# EAGLE design BigTime45 (EAGLE 7.6.0)
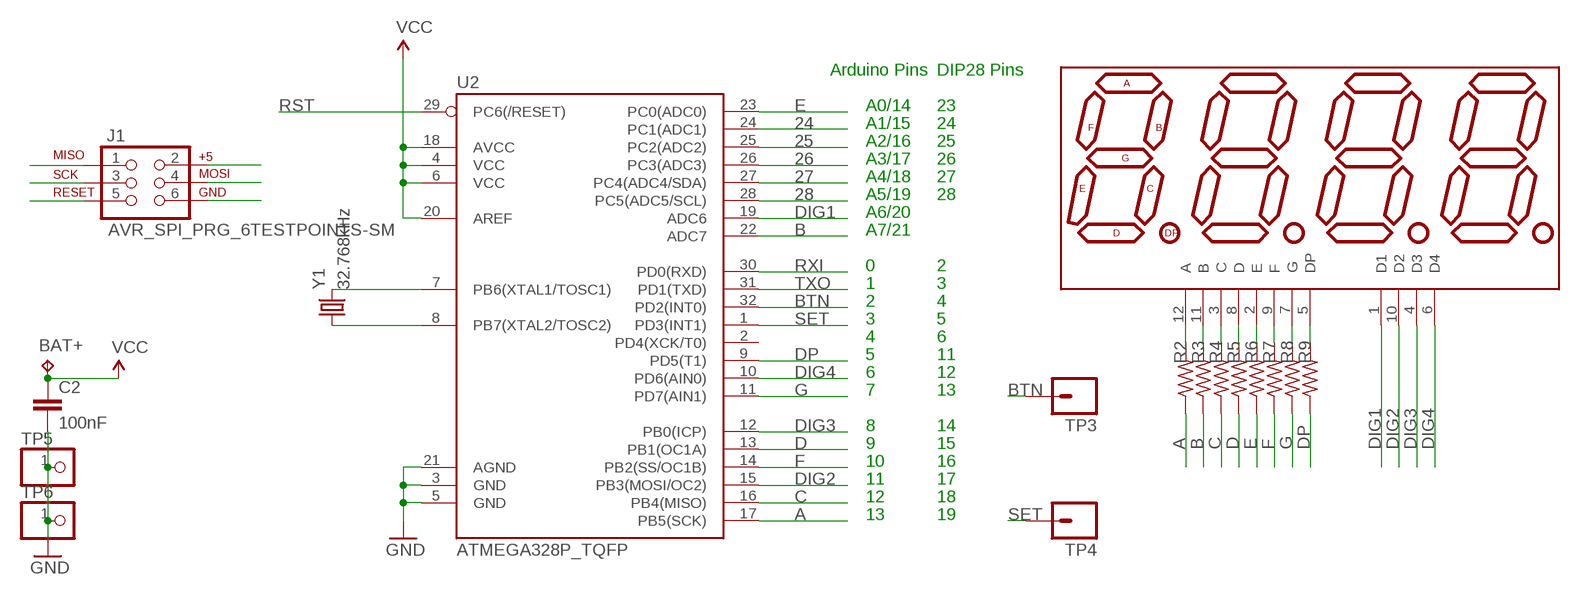
[diagram p0: schematic, sheet 1]

## Parts
BAT+  TPTP20R  [TP20R]
C2  100nF  C-EUC0805  [C0805]
DISP1  7-SEGMENT-4DIGIT-COUNTER-HP-BUBBLE-SM  [DIL12_SM]
J1  AVR_SPI_PRG_6TESTPOINTS-SM  [2X3_TEST_POINTS_SM]
R2  330  R-US_R0805  [R0805]
R3  330  R-US_R0805  [R0805]
R4  330  R-US_R0805  [R0805]
R5  330  R-US_R0805  [R0805]
R6  330  R-US_R0805  [R0805]
R7  330  R-US_R0805  [R0805]
R8  330  R-US_R0805  [R0805]
R9  330  R-US_R0805  [R0805]
TP3  M01EDGE_CONTACT  [WATCHBTN]
TP4  M01EDGE_CONTACT  [WATCHBTN]
TP5  PINHD-1X1CB  [1X01-CLEANBIG]
TP6  PINHD-1X1CB  [1X01-CLEANBIG]
U2  ATMEGA328P_TQFP  [TQFP32-08]
Y1  32.768kHz  CRYSTALTC26H  [TC26H]

## Nets
24: U2.24(PC1(ADC1))
25: U2.25(PC2(ADC2))
26: U2.26(PC3(ADC3))
27: U2.27(PC4(ADC4/SDA))
28: U2.28(PC5(ADC5/SCL))
A: J1.3 R2.1 U2.17(PB5(SCK))
B: R3.1 U2.22(ADC7)
BTN: TP3.1 U2.32(PD2(INT0))
C: J1.1 R4.1 U2.16(PB4(MISO))
D: R5.1 U2.13(PB1(OC1A))
DIG1: DISP1.1(D1) U2.19(ADC6)
DIG2: DISP1.10(D2) J1.4 U2.15(PB3(MOSI/OC2))
DIG3: DISP1.4(D3) U2.12(PB0(ICP))
DIG4: DISP1.6(D4) U2.10(PD6(AIN0))
DP: R9.1 U2.9(PD5(T1))
E: R6.1 U2.23(PC0(ADC0))
F: R7.1 U2.14(PB2(SS/OC1B))
G: R8.1 U2.11(PD7(AIN1))
GND: C2.2 J1.6 TP5.1 TP6.1 U2.3(GND) U2.5(GND) U2.21(AGND)
N$1: U2.8(PB7(XTAL2/TOSC2)) Y1.1
N$2: U2.7(PB6(XTAL1/TOSC1)) Y1.2
N$4: DISP1.12(A) R2.2
N$5: DISP1.11(B) R3.2
N$6: DISP1.3(C) R4.2
N$7: DISP1.8(D) R5.2
N$8: DISP1.2(E) R6.2
N$9: DISP1.9(F) R7.2
N$10: DISP1.7(G) R8.2
N$11: DISP1.5(DP) R9.2
RST: J1.5 U2.29(PC6(/RESET))
RXI: U2.30(PD0(RXD))
SET: TP4.1 U2.1(PD3(INT1))
TXO: U2.31(PD1(TXD))
VCC: BAT+.TP C2.1 J1.2 U2.4(VCC) U2.6(VCC) U2.18(AVCC) U2.20(AREF)
Unconnected: U2.2(PD4(XCK/T0))

## Notes on the sheet
- Arduino Pins | DIP28 Pins
- A0/14 | 23
- A1/15 | 24
- A2/16 | 25
- A3/17 | 26
- A4/18 | 27
- A5/19 | 28
- A6/20
- A7/21
- 0 | 2
- 1 | 3
- 2 | 4
- 3 | 5
- 4 | 6
- 5 | 11
- 6 | 12
- 7 | 13
- 8 | 14
- 9 | 15
- 10 | 16
- 11 | 17
- 12 | 18
- 13 | 19

## Library data of the parts
BAT+ = testpad:TP: Test pad
C2 = resistor:C-EU: CAPACITOR, European symbol
DISP1 = BigTime:7-SEGMENT-4DIGIT-COUNTER: HP Bubble display, with pins bent under and clipped, for surface-mounting.
J1 = Connectors:AVR_SPI_PRG_6: AVR ISP 6 Pin This is the reduced ISP connector for AVR programming. Common on Arduino. This footprint will take up less PCB space and can be used with a 10-pin to 6-pin adapter such as SKU: BOB-08508 **Special note about "TEST_POINT" package. The stop mask is on the top side, so if you want your programming test points to be on the bottom of your board, make sure to place this package on the bottom side of the board. This also ensure that the orientation to program from the bottom side will be correct.
R2-R9 = resistor:R-US_: RESISTOR, American symbol
TP3 TP4 = Connectors:M01: Header 1 Standard 1-pin 0.1" header. Use with straight break away headers (SKU : PRT-00116), right angle break away headers (PRT-00553), swiss pins (PRT-00743), machine pins (PRT-00117), and female headers (PRT-00115). SMTSO-256-ET is a "flush mount" nut for a 4-40 screw. The older package used to be too tight, and did not allow it to sit properly thru the drill hit. The latest (0.165DIA) fits nice and snug.
TP5 TP6 = adafruit:PINHD-1X1: Pin header 1x1 for 0.1" spacing With round pins
U2 = SparkFun-DigitalIC:ATMEGA328P_TQFP; PROD_ID: IC-09069
Y1 = BigTime:CRYSTAL: CRYSTAL; OC_FARNELL: unknown; OC_NEWARK: unknown

## Board
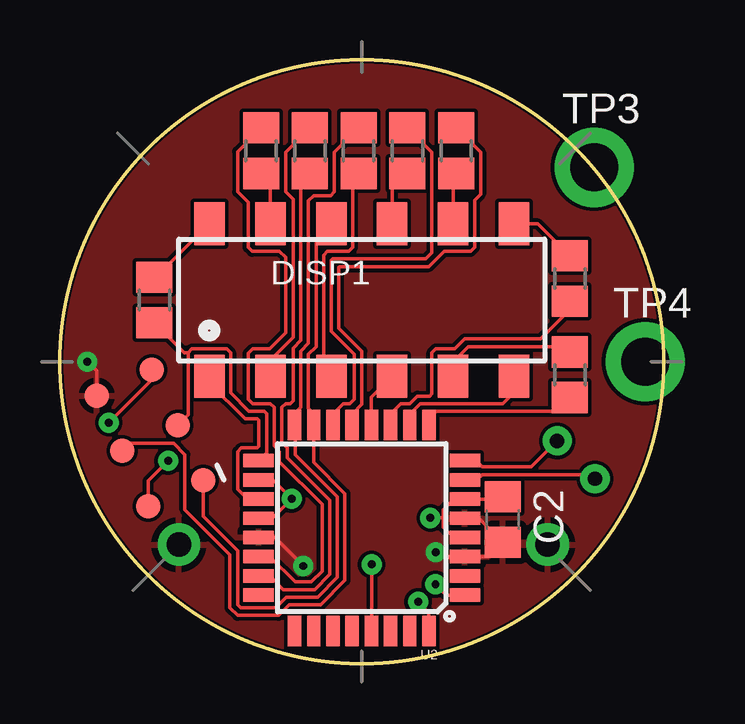
[diagram p1: board, top side]
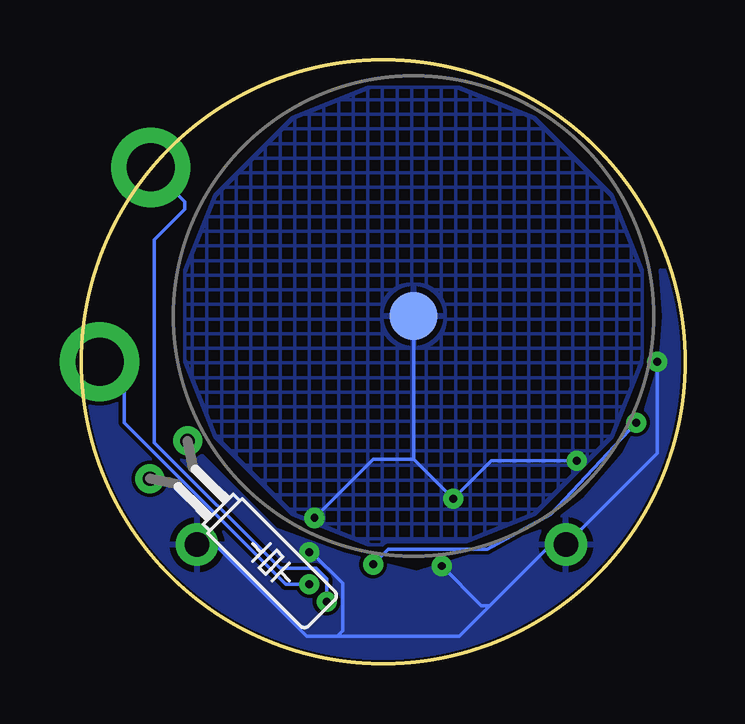
[diagram p2: board, bottom side, seen from below]

Size 25.15 x 25.15 mm. Coordinates in mm from the lower left corner, seen from the top.
Outline: circle at 12.57,12.57 radius 12.57
Copper layers (1*16): Top 0.0028mm / dielectric 30mil / Bottom 0.0028mm
Design rules "oshpark *": minimum track width 6mil, minimum drill 13mil, track to track 6mil, track to pad 6mil, pad to pad 6mil, via to via 6mil, smd to smd 6mil, copper to edge 3mil, drill to drill 6mil, minimum pad ring 12mil, minimum via ring 10mil, stop-mask expansion 4mil, vias tented up to drill 20mil, thermal gap 10mil

### Footprints (pad centres in the part's own frame; a part is rotated, then mirrored left to right if it is on the bottom)
TP20R = smd 2 x 2: TP 0,0
C0805 = smd 1.3 x 1.5: 1 -0.95,0; 2 0.95,0
DIL12_SM = smd 1.27 x 1.778: 1 -6.35,-3.175; 2 -3.81,-3.175; 3 -1.27,-3.175; 4 1.27,-3.175; 5 3.81,-3.175; 6 6.35,-3.175; 7 6.35,3.175; 8 3.81,3.175; 9 1.27,3.175; 10 -1.27,3.175; 11 -3.81,3.175; 12 -6.35,3.175
2X3_TEST_POINTS_SM = smd 1.016 x 1.016: 1 -2.54,-1.27; 2 -2.54,1.27; 3 0,-1.27; 4 0,1.27; 5 2.54,-1.27; 6 2.54,1.27
R0805 = smd 1.3 x 1.5: 1 -0.95,0; 2 0.95,0
1X01_2MM = drill 2 pad 3.302: 1 0,0
1X01-CLEANBIG = drill 1.016 pad 1.778: 1 0,0
TQFP32-08 = smd 1.27 x 0.559: 1 -4.293,2.8; 2 -4.293,2; 3 -4.293,1.2; 4 -4.293,0.4; 5 -4.293,-0.4; 6 -4.293,-1.2; 7 -4.293,-2; 8 -4.293,-2.8; 17 4.293,-2.8; 18 4.293,-2; 19 4.293,-1.2; 20 4.293,-0.4; 21 4.293,0.4; 22 4.293,1.2; 23 4.293,2; 24 4.293,2.8 | smd 0.559 x 1.27: 9 -2.8,-4.293; 10 -2,-4.293; 11 -1.2,-4.293; 12 -0.4,-4.293; 13 0.4,-4.293; 14 1.2,-4.293; 15 2,-4.293; 16 2.8,-4.293; 25 2.8,4.293; 26 2,4.293; 27 1.2,4.293; 28 0.4,4.293; 29 -0.4,4.293; 30 -1.2,4.293; 31 -2,4.293; 32 -2.8,4.293
TC26H = drill 0.6: 1 -1.114,-1.27; 2 1.114,-1.27

### Placement (x,y rotation side)
BAT+  11.3,14.48 0 bottom
C2  18.45,6 270 top
DISP1  12.57,15.14 0 top
J1  3.75,9.4 115 top
R2  3.94,15.14 90 top
R3  8.38,21.37 270 top
R4  12.45,21.37 270 top
R5  16.51,21.37 270 top
R6  10.41,21.37 90 top
R7  14.48,21.37 270 top
R8  21.24,16.04 90 top
R9  21.24,12.03 90 top
TP3  [1X01_2MM]  22.26,20.67 0 top
TP4  [1X01_2MM]  24.38,12.57 0 top
TP5  4.95,4.95 0 top
TP6  20.32,4.95 0 top
U2  12.57,5.65 180 top
Y1  20.61,7.59 225 bottom

### Tracks (layer width: path | path; a pad name or v marks a point on that pad's centre or on a via)
A
  Top 0.152: U2.17 8.6,8.77 8.6,10.41 8.51,10.51 7.87,10.51 7.11,11.27 7.11,12.95 6.95,13.11 5.49,13.11 5.33,12.95 | J1.3 5.33,10.37 5.33,12.95 | R2.1 5.18,12.95 5.33,12.95
B
  Top 0.152: U2.22 8.74,4.45 9.79,3.4 10.48,3.4 10.92,3.84 10.92,6.64 9.14,8.41 9.14,8.83 8.95,9.05 8.92,9.08 8.92,10.67 8.76,10.83 8.03,10.83 7.84,11.02 7.84,12.92 8.03,13.11 8.73,13.11 9.4,13.78 9.4,16.92 9.14,17.18 8,17.18 7.84,17.34 7.84,19.21 7.4,19.65 7.4,21.33 R3.1
BTN  (via drill 0.33)
  Top 0.152: U2.32 15.37,2.12 v14.92,2.57
  Bottom 0.152: v14.92,2.57 14.92,3.52 15.37,3.97 16.86,3.97 22.1,9.21 22.1,17.65 20.83,18.92 20.83,19.24 TP3.1
C
  Top 0.152: 6.16,7.44 J1.1 5.97,6.13 7.4,4.7 7.4,2.44 7.53,2.32 8.98,2.32 9.43,2.76 10.73,2.76 11.56,3.59 11.56,6.95 9.8,8.71 9.8,9.91 U2.16 9.77,10.41 10.03,10.67 10.03,13.02 10.35,13.33 10.35,19.27 10.57,19.49 11.27,19.49 11.43,19.65 11.43,21.3 R4.1
D
  Top 0.152: U2.13 12.17,10.39 12.57,10.79 12.57,13.02 11.62,13.97 11.62,16.51 11.65,16.54 15.37,16.54 16,17.18 17.11,17.18 17.27,17.34 17.27,19.3 17.53,19.56 17.53,21.3 R5.1
DIG1
  Top 0.152: U2.19 7.82,6.85 7.4,7.27 7.4,8.83 7.56,8.98 8.22,8.98 8.29,9.05 8.29,10.13 8.22,10.19 7.71,10.19 6.22,11.68 DISP1.1
DIG2
  Top 0.152: DISP1.10 10.67,17.68 10.67,13.21 10.35,12.89 10.35,10.64 10.57,10.41 U2.15 10.57,8.38 11.87,7.08 11.87,3.46 10.86,2.44 9.56,2.44 9.11,2 7.4,2 7.08,2.32 7.08,4.54 5.21,6.41 5.21,8.7 4.73,9.18 2.91,9.18 J1.4
DIG3
  Top 0.152: U2.12 12.97,11.1 DISP1.4
DIG4
  Top 0.152: DISP1.6 18.92,11.3 18.45,10.83 15.02,10.83 14.57,10.38 U2.10
DP
  Top 0.152: U2.9 15.37,10.2 15.68,10.51 20.79,10.51 R9.1
E
  Top 0.152: U2.23 8.73,3.65 9.3,3.08 10.6,3.08 11.24,3.71 11.24,6.79 9.46,8.57 9.46,8.98 9.24,9.21 9.24,10.67 9.4,10.83 9.59,10.83 9.72,10.95 9.72,13.14 10.03,13.46 10.03,20.04 R6.1
F
  Top 0.152: U2.14 11.37,10.39 11.81,10.83 12.06,10.83 12.26,11.02 12.26,12.89 11.3,13.84 11.3,16.8 11.37,16.86 15.24,16.86 15.49,17.11 15.49,21.3 R7.1
G
  Top 0.152: U2.11 13.77,10.41 14.19,10.83 14.57,10.83 14.89,11.14 15.4,11.14 15.49,11.24 15.49,12.95 15.65,13.11 16.45,13.11 16.86,13.52 20.03,13.52 21.24,14.73 R8.1
GND  (via drill 0.33)
  Top 0.152: U2.21 8.94,5.25 v10.13,4.06 | J1.6 1.52,12.19 v1.14,12.57 | v15.65,4.63 15.84,4.45 U2.3 17.85,4.45 C2.2 17.45,6.05 U2.5
  Bottom 0.152: TP6.1 19.56,4.95 15.75,1.14 14.48,1.14 | 8.13,2.41 5.59,4.95 TP5.1 1.14,8.76 v1.14,12.57 | 8.13,2.41 9.4,1.14 14.48,1.14 | v10.13,4.06 8.48,2.41 8.13,2.41 | v15.65,4.63 15.56,4.63 14.26,3.33 14.26,1.36 14.48,1.14
  pour Bottom: 2.54,8.76 4.19,6.86 5.84,5.59 8.26,4.7 11.18,3.81 14.22,4.57 17.02,5.59 20.19,8.76 21.46,11.94 25.91,11.94 24.64,6.86 22.1,3.05 18.29,0.51 13.21,-0.76 11.94,-0.76 6.86,0.51 3.05,3.05 0.51,6.86 -0.76,10.67 -0.13,16.38 1.02,16.38 0.89,14.48 1.02,12.57 1.65,10.54
  pour Top: 21.46,3.05 17.65,0.51 15.11,-0.13 10.03,-0.13 6.22,1.14 3.68,3.05 1.14,6.22 0.51,8.13 -0.13,10.67 -0.13,15.11 1.14,18.92 3.68,22.1 5.59,23.37 8.13,24.64 10.67,25.27 14.48,25.27 17.02,24.64 19.56,23.37 22.1,21.46 23.37,19.56 24.64,17.02 25.27,14.48 25.27,10.03 24,6.86
N$1
  Top 0.152: Y1.1 19.63,8.19 17.59,8.19 17.33,8.45 U2.8
N$2
  Top 0.152: U2.7 17.37,7.65 17.59,7.87 22.12,7.87 Y1.2
N$4
  Top 0.152: R2.2 4,16.09 DISP1.12
N$5
  Top 0.152: R3.2 8.76,20.04 DISP1.11
N$6
  Top 0.152: DISP1.3 10.99,12.29 10.99,17.02 11.14,17.18 12.03,17.18 12.19,17.34 12.19,20.16 R4.2
N$7
  Top 0.152: R5.2 16.38,20.29 DISP1.8
N$8
  Top 0.152: DISP1.2 8.76,12.64 9.72,13.59 9.72,19.34 9.4,19.65 9.4,21.3 R6.2
N$9
  Top 0.152: R7.2 13.84,19.78 DISP1.9
N$10
  Top 0.152: R8.2 19.91,18.32 DISP1.7
N$11
  Top 0.152: R9.2 21.02,13.21 17.02,13.21 16.38,12.57 DISP1.5
RST  (via drill 0.33)
  Top 0.152: J1.5 3.82,11.82 v2.03,10.03 | v12.99,4.13 U2.29
  Bottom 0.152: v2.03,10.03 5.59,6.22 8.22,4.76 12.35,4.76 v12.99,4.13
SET  (via drill 0.33)
  Top 0.152: U2.1 16.1,2.85 v15.65,3.3
  Bottom 0.152: TP4.1 24,12.57 23.37,11.94 23.37,10.03 16.64,3.3 v15.65,3.3
VCC  (via drill 0.33)
  Top 0.152: U2.4 16.4,5.25 15.97,5.68 15.97,6.06 | 15.97,6.06 15.97,6.41 16.41,6.85 U2.6 18.35,6.85 C2.1 | v15.43,6.06 15.97,6.06 | U2.18 8.86,7.65 v9.65,6.86 8.85,6.05 U2.20 | J1.2 3.67,7.61 v4.51,8.45
  Bottom 0.152: BAT+.TP 11.3,8.51 | 11.3,8.51 12.99,8.51 v15.43,6.06 | 11.3,8.51 v9.65,6.86 8.06,8.45 v4.51,8.45
  pour Bottom (hatched): 9.4,24 13.21,24 16.38,22.73 19.56,19.56 20.83,16.38 20.83,12.57 19.56,9.4 16.38,6.22 13.21,4.95 9.4,4.95 6.22,6.22 3.05,9.4 1.78,12.57 1.78,16.38 3.05,19.56 6.22,22.73

### Text on the board
Document: N. Seidle